# EAGLE design geiger_counter (EAGLE 6.6.0)
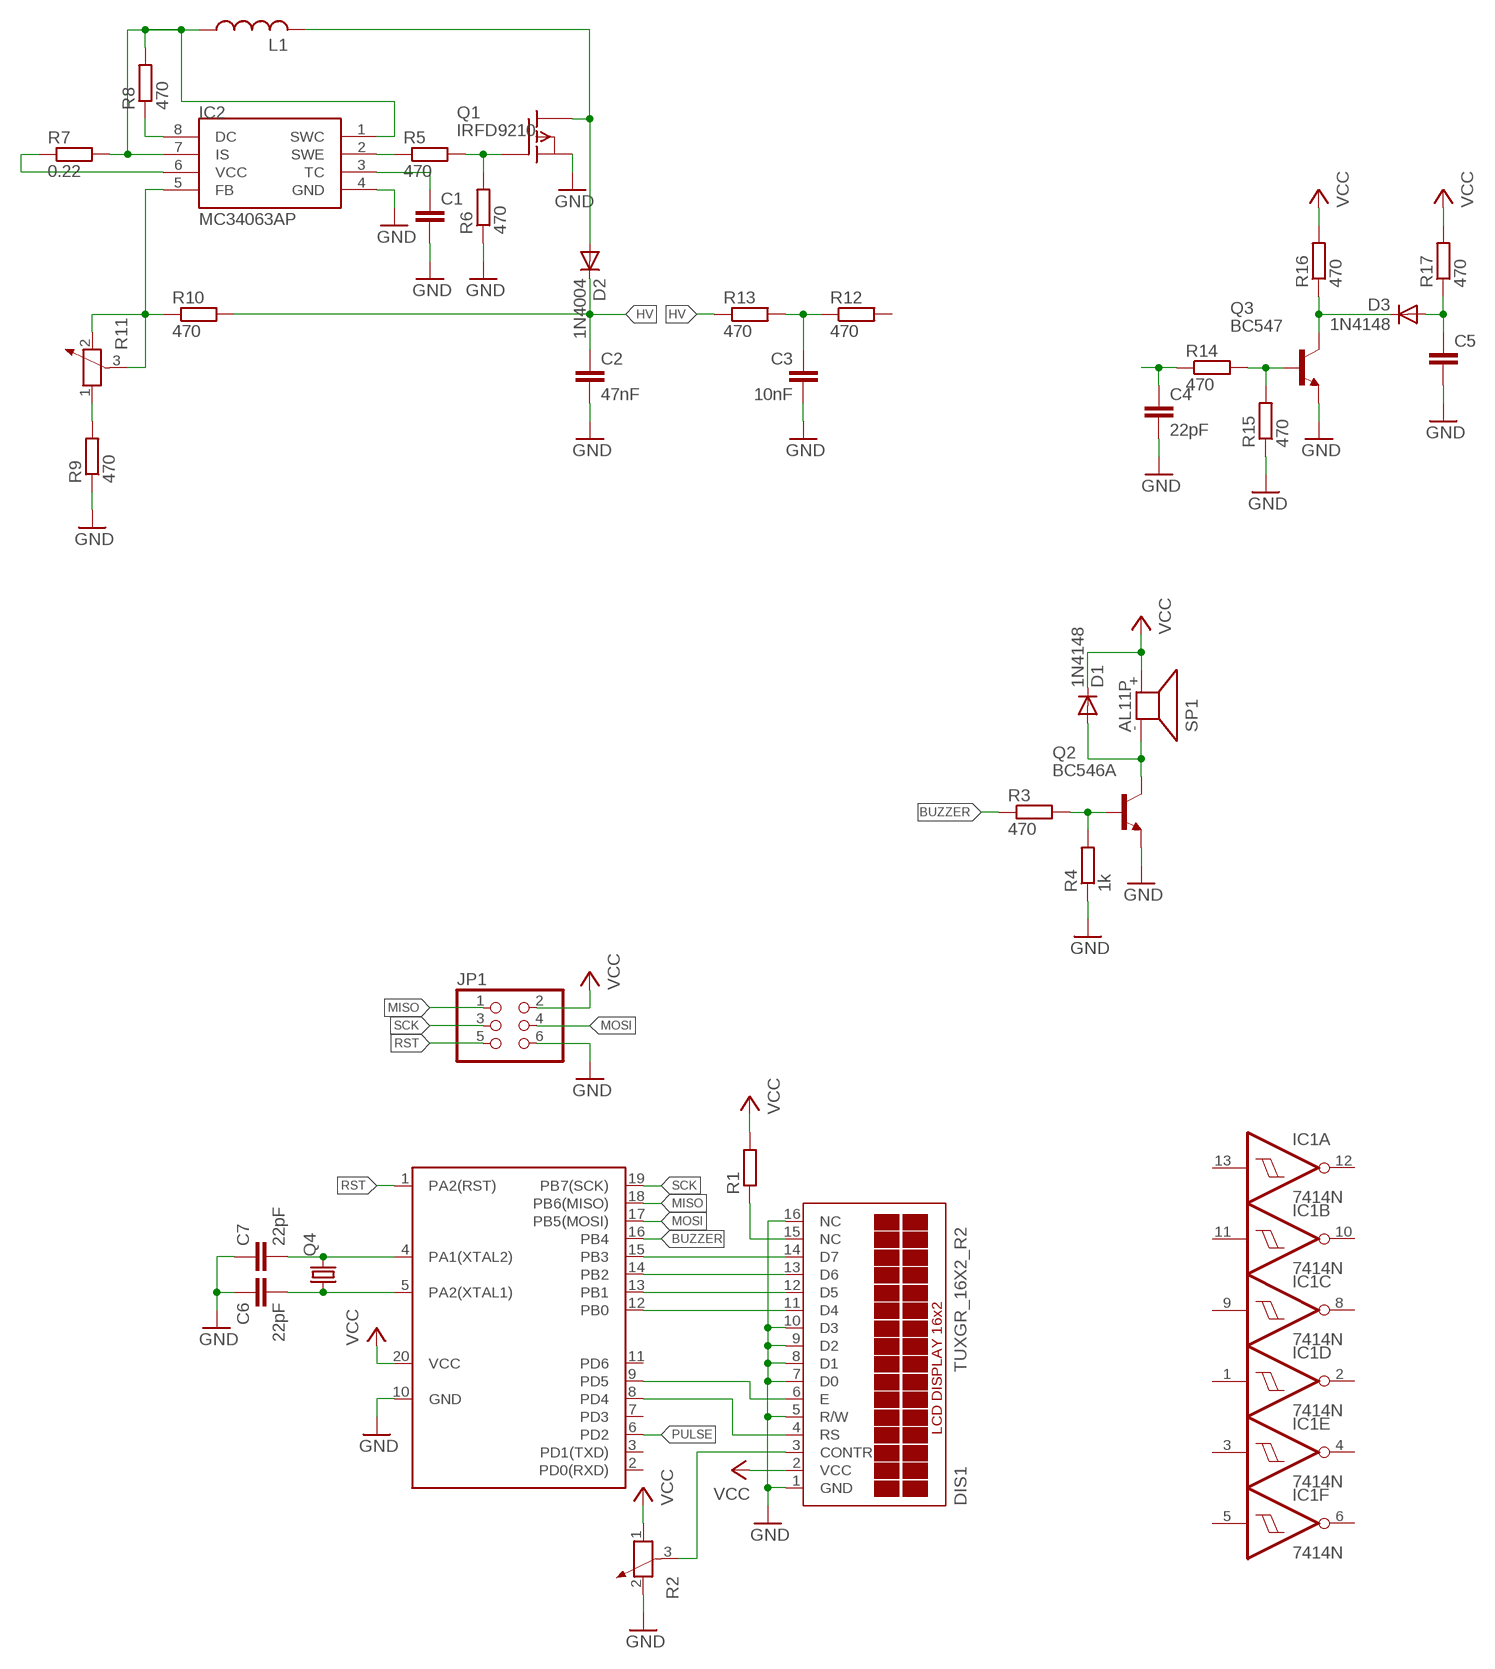
[diagram p0: schematic, sheet 1]

## Parts
C1  C-EU050-024X044  [C050-024X044]
C2  47nF  C-EU075-052X106  [C075-052X106]
C3  10nF  C-EU075-032X103  [C075-032X103]
C4  22pF  C-EU050-024X044  [C050-024X044]
C5  C-EU050-024X044  [C050-024X044]
C6  22pF  C-EU050-024X044  [C050-024X044]
C7  22pF  C-EU050-024X044  [C050-024X044]
D1  1N4148  1N4148DO35-7  [DO35-7]
D2  1N4004  [DO41-10]
D3  1N4148  1N4148DO35-7  [DO35-7]
DIS1  TUXGR_16X2_R2  [TUXGR_16X2_R2]
IC1  7414N  [DIL14]
IC2  MC34063AP  [DIL08]
JP1  PINHD-2X3  [2X03]
L1  L-US6000-XXX-RC  [6000-XXXX-RC]
Q1  IRFD9210  [DIL04]
Q2  BC546A  [TO92-EBC]
Q3  BC547  -NPN-TO92-EBC  [TO92-EBC]
Q4  CRYSTALHC18U-V  [HC18U-V]
R1  R-EU_0207/15  [0207/15]
R2  POTENTIOMETER_PT-10  [PT-10]
R3  470  R-EU_0204/7  [0204/7]
R4  1k  R-EU_0204/7  [0204/7]
R5  470  R-EU_0204/7  [0204/7]
R6  470  R-EU_0204/7  [0204/7]
R7  0.22  R-EU_0617/17  [0617/17]
R8  470  R-EU_0204/7  [0204/7]
R9  470  R-EU_0204/7  [0204/7]
R10  470  R-EU_0204/7  [0204/7]
R11  POTENTIOMETER_PT-10  [PT-10]
R12  470  R-EU_0204/7  [0204/7]
R13  470  R-EU_0204/7  [0204/7]
R14  470  R-EU_0204/7  [0204/7]
R15  470  R-EU_0204/7  [0204/7]
R16  470  R-EU_0204/7  [0204/7]
R17  470  R-EU_0204/7  [0204/7]
SP1  AL11P  [AL11P]
U$1  TINY2313  [DIL20]

## Nets
BUZZER: R3.1 U$1.16(PB4)
GND: C1.2 C2.2 C3.2 C4.2 C5.2 C6.1 C7.1 DIS1.1(GND) DIS1.5(R/W) DIS1.7(D0) DIS1.8(D1) DIS1.9(D2) DIS1.10(D3) DIS1.16(NC) IC2.4(GND) JP1.6 Q1.2(S) Q2.E Q3.E R2.2 R4.1 R6.1 R9.1 R15.1 U$1.10(GND)
HV: C2.1 D2.C R10.2 R13.1
MISO: JP1.1 U$1.18(PB6(MISO))
MOSI: JP1.4 U$1.17(PB5(MOSI))
N$1: DIS1.11(D4) U$1.12(PB0)
N$2: DIS1.12(D5) U$1.13(PB1)
N$3: DIS1.13(D6) U$1.14(PB2)
N$4: DIS1.14(D7) U$1.15(PB3)
N$5: DIS1.6(E) U$1.9(PD5)
N$6: DIS1.4(RS) U$1.8(PD4)
N$7: DIS1.15(NC) R1.1
N$8: DIS1.3(CONTR) R2.3
N$9: IC2.8(DC) R8.1
N$10: D1.A Q2.C SP1.-
N$11: IC2.1(SWC) IC2.7(IS) L1.1 R7.2 R8.2
N$12: Q2.B R3.2 R4.2
N$13: C1.1 IC2.3(TC)
N$14: IC2.2(SWE) R5.1
N$15: Q1.1(G) R5.2 R6.2
N$16: D2.A L1.2 Q1.3(D) Q1.4(D)
N$17: IC2.5(FB) R10.1 R11.2 R11.3
N$18: Q3.B R14.2 R15.2
N$19: IC2.6(VCC) R7.1
N$20: R9.2 R11.1
N$21: C3.1 R12.1 R13.2
N$22: C4.1 R14.1
N$23: D3.C Q3.C R16.1
N$24: C5.1 D3.A R17.1
N$25: C7.2 Q4.2 U$1.4(PA1(XTAL2))
N$26: C6.2 Q4.1 U$1.5(PA2(XTAL1))
PULSE: U$1.6(PD2)
RST: JP1.5 U$1.1(PA2(RST))
SCK: JP1.3 U$1.19(PB7(SCK))
VCC: D1.C DIS1.2(VCC) JP1.2 R1.2 R2.1 R16.2 R17.2 SP1.+ U$1.20(VCC)
Unconnected: IC1.1(D:I) IC1.2(D:O) IC1.3(E:I) IC1.4(E:O) IC1.5(F:I) IC1.6(F:O) IC1.8(C:O) IC1.9(C:I) IC1.10(B:O) IC1.11(B:I) IC1.12(A:O) IC1.13(A:I) R12.2 U$1.2(PD0(RXD)) U$1.3(PD1(TXD)) U$1.7(PD3) U$1.11(PD6)

## Power pins joined to a net without a drawn wire
GND: IC1.7(P:GND)
VCC: IC1.14(P:VCC)

## Library data of the parts
C1-C7 = rcl:C-EU: CAPACITOR, European symbol
D1 D3 = diode:1N4148: DIODE high speed (Philips)
D2 = diode:1N4004: DIODE general purpose rectifier, 1 A
DIS1 = display-lcd:TUXGR_16X2_R2: Tuxgraphics LCD display 16x2 characters reflective, without background light Source: tuxgr_12x2_r2.pdf; OC_FARNELL: unknown; OC_NEWARK: unknown
IC1 = 74xx-eu:74*14: Hex schmitt trigger INVERTER
IC2 = mc34063:MC34063
JP1 = pinhead:PINHD-2X3: PIN HEADER
L1 = rcl:L-US: INDUCTOR, American symbol
Q1 = transistor-fet:IRFD9210: P-Channel Enhancement MOSFET
Q2 = transistor-npn:BC546*: NPN Transistor
Q3 = transistor:*-NPN-: NPN Transistror BF959 corrected 2008.03.06
Q4 = crystal:CRYSTAL: CRYSTAL; OC_FARNELL: unknown; OC_NEWARK: unknown
R1 R3-R10 R12-R17 = rcl:R-EU_: RESISTOR, European symbol
R2 R11 = rcl:POTENTIOMETER_: Potentiometer
SP1 = buzzer:AL11P: SPEAKER Source: Buerklin; OC_FARNELL: unknown; OC_NEWARK: unknown
U$1 = atmel:TINY2313

## Board
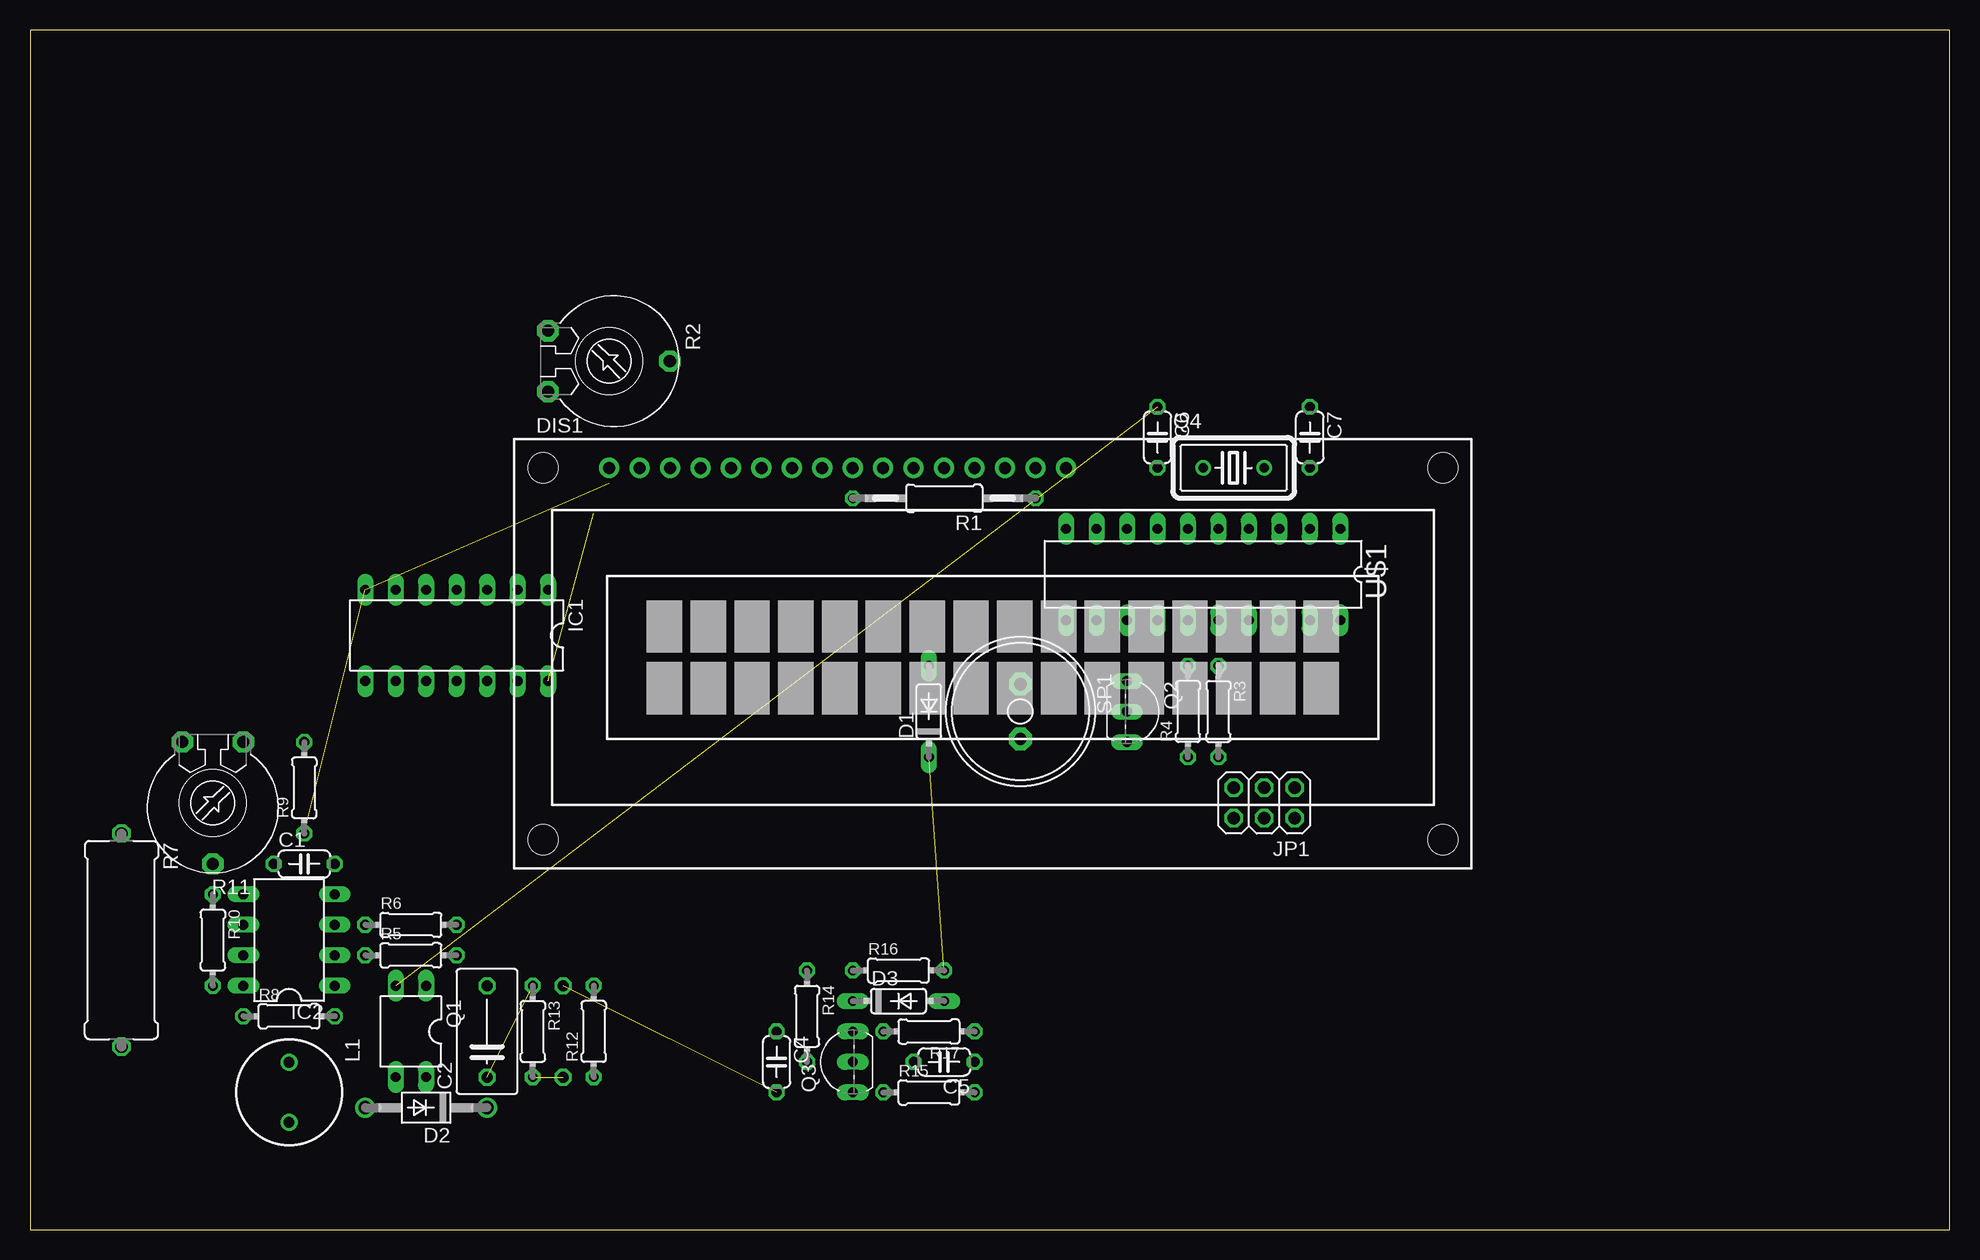
[diagram p1: board, top side]
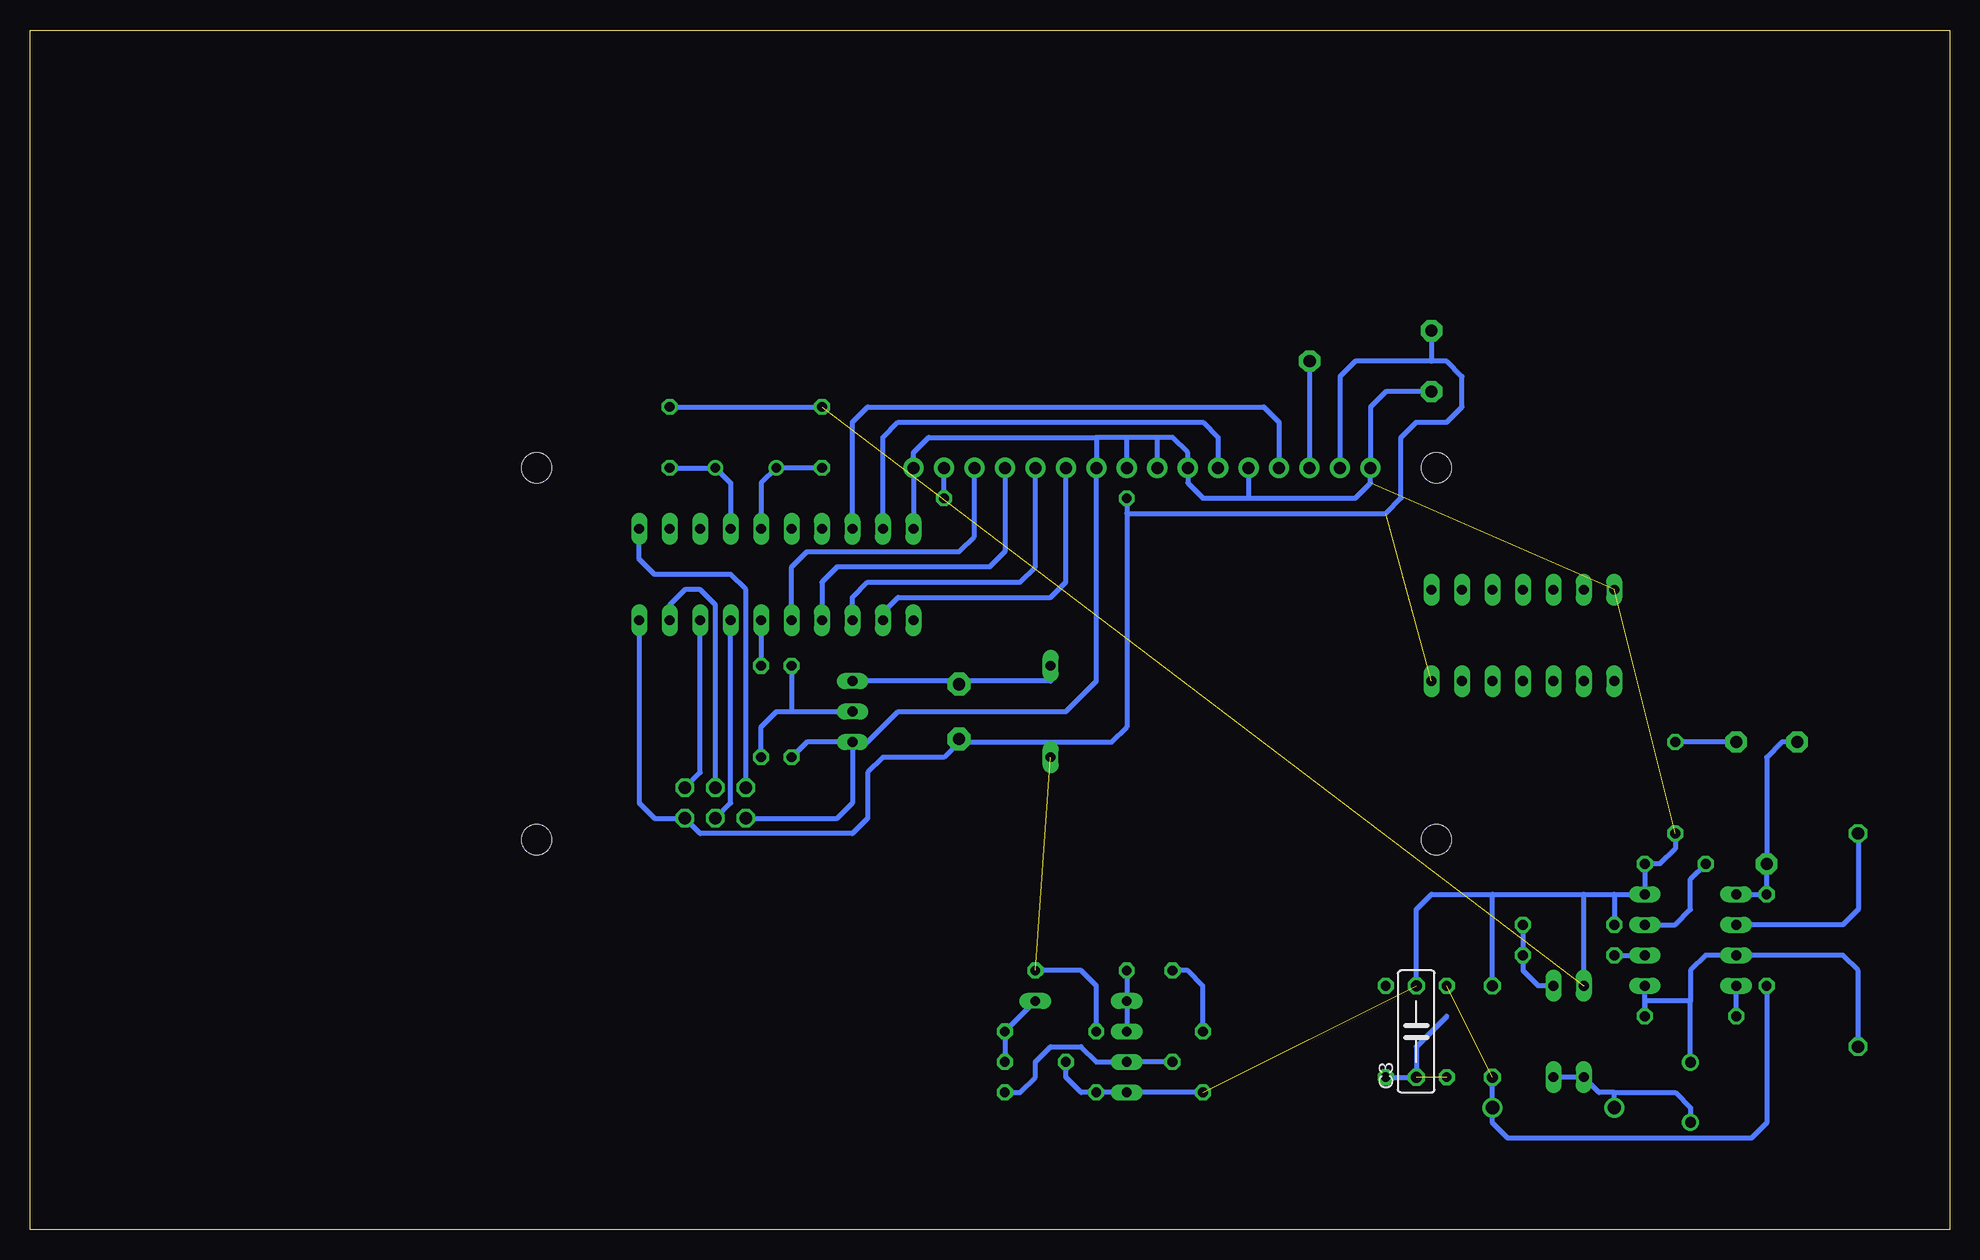
[diagram p2: board, bottom side, seen from below]

Size 160 x 100 mm. Coordinates in mm from the lower left corner, seen from the top.
Outline: 0,0 160,0 160,100 0,100 0,0
Copper layers (1*16): Top 0.035mm / dielectric 1.5mm / Bottom 0.035mm
Design rules "default": minimum track width 10mil, minimum drill 24mil, track to track 8mil, track to pad 8mil, pad to pad 8mil, via to via 8mil, smd to smd 8mil, copper to edge 40mil, drill to drill 8mil, minimum pad ring 10mil, minimum via ring 8mil, stop-mask expansion 4mil, vias tented up to drill 0mil, thermal gap 10mil

### Footprints (pad centres in the part's own frame; a part is rotated, then mirrored left to right if it is on the bottom)
C050-024X044 = drill 0.813 octagon: 1 -2.54,0; 2 2.54,0
C075-052X106 = drill 0.914 octagon: 1 -3.81,0; 2 3.81,0
C075-032X103 = drill 0.914 octagon: 1 -3.81,0; 2 3.81,0
DO35-7 = drill 0.813 long: A 3.81,0; C -3.81,0
DO41-10 = drill 1.118: A 5.08,0; C -5.08,0
TUXGR_16X2_R2 = drill 1 pad 1.676: 1 -33.02,15.24; 2 -30.48,15.24; 3 -27.94,15.24; 4 -25.4,15.24; 5 -22.86,15.24; 6 -20.32,15.24; 7 -17.78,15.24; 8 -15.24,15.24; 9 -12.7,15.24; 10 -10.16,15.24; 11 -7.62,15.24; 12 -5.08,15.24; 13 -2.54,15.24; 14 0,15.24; 15 2.54,15.24; 16 5.08,15.24 | hole 2.5: -38.52,-15.76; 36.48,-15.76; -38.52,15.24; 36.48,15.24
DIL14 = drill 0.813 long: 1 -7.62,-3.81; 2 -5.08,-3.81; 3 -2.54,-3.81; 4 0,-3.81; 5 2.54,-3.81; 6 5.08,-3.81; 7 7.62,-3.81; 8 7.62,3.81; 9 5.08,3.81; 10 2.54,3.81; 11 0,3.81; 12 -2.54,3.81; 13 -5.08,3.81; 14 -7.62,3.81
DIL08 = drill 0.813 long: 1 -3.81,-3.81; 2 -1.27,-3.81; 3 1.27,-3.81; 4 3.81,-3.81; 5 3.81,3.81; 6 1.27,3.81; 7 -1.27,3.81; 8 -3.81,3.81
2X03 = drill 1.016 octagon: 1 -2.54,-1.27; 2 -2.54,1.27; 3 0,-1.27; 4 0,1.27; 5 2.54,-1.27; 6 2.54,1.27
6000-XXXX-RC = drill 0.9 pad 1.422: 1 -2.5,0; 2 2.5,0
DIL04 = drill 0.813 long: 1 -1.27,-3.81; 2 1.27,-3.81; 3 1.27,3.81; 4 -1.27,3.81
TO92-EBC = drill 0.813 long: B 0,-1.27; C -2.54,-1.27; E 2.54,-1.27
TO92-EBC' = drill 0.813 long: B 0,-1.27; C 2.54,-1.27; E -2.54,-1.27
HC18U-V = drill 0.813: 1 -2.54,0; 2 2.54,0
0207/15 = drill 0.813 octagon: 1 -7.62,0; 2 7.62,0
PT-10 = drill 1.016 pad 1.778 octagon: 1 -2.54,-5.08; 2 2.54,-5.08; 3 0,5.08
0204/7 = drill 0.813 octagon: 1 -3.81,0; 2 3.81,0
0617/17 = drill 1.016 octagon: 1 -8.89,0; 2 8.89,0
AL11P = drill 1.016 pad 1.905 octagon: + 2.286,0; - -2.286,0
DIL20 = drill 0.813 long: 1 -11.43,-3.81; 2 -8.89,-3.81; 3 -6.35,-3.81; 4 -3.81,-3.81; 5 -1.27,-3.81; 6 1.27,-3.81; 7 3.81,-3.81; 8 6.35,-3.81; 9 8.89,-3.81; 10 11.43,-3.81; 11 11.43,3.81; 12 8.89,3.81; 13 6.35,3.81; 14 3.81,3.81; 15 1.27,3.81; 16 -1.27,3.81; 17 -3.81,3.81; 18 -6.35,3.81; 19 -8.89,3.81; 20 -11.43,3.81

### Placement (x,y rotation side)
C1  22.86,30.48 0 top
C2  38.1,16.51 90 top
C3  44.45,16.51 90 bottom
C4  62.23,13.97 270 top
C5  76.2,13.97 180 top
C6  93.98,66.04 270 top
C7  106.68,66.04 270 top
D1  74.93,43.18 90 top
D2  33.02,10.16 180 top
D3  72.39,19.05 0 top
DIS1  81.28,48.26 0 top
IC1  35.56,49.53 180 top
IC2  21.59,24.13 90 top
JP1  102.87,35.56 180 top
L1  21.59,11.43 270 top
Q1  31.75,16.51 180 top
Q2  92.71,43.18 270 top
Q3  BC547  [TO92-EBC']  67.31,13.97 90 top
Q4  100.33,63.5 0 top
R1  76.2,60.96 180 top
R2  48.26,72.39 270 top
R3  99.06,43.18 270 top
R4  96.52,43.18 90 top
R5  31.75,22.86 0 top
R6  31.75,25.4 0 top
R7  7.62,24.13 270 top
R8  21.59,17.78 0 top
R9  22.86,36.83 90 top
R10  15.24,24.13 270 top
R11  15.24,35.56 180 top
R12  46.99,16.51 90 top
R13  41.91,16.51 270 top
R14  64.77,17.78 270 top
R15  74.93,11.43 0 top
R16  72.39,21.59 0 top
R17  74.93,16.51 180 top
SP1  82.55,43.18 270 top
U$1  97.79,54.61 180 top

### Tracks (layer width: path | path; a pad name or v marks a point on that pad's centre or on a via)
BUZZER
  Bottom 0.406: U$1.16 R3.1
GND  (4 unrouted)
  Bottom 0.406: 71.12,66.04 85.09,66.04 86.36,64.77 DIS1.16 U$1.10 | 71.12,66.04 DIS1.10 71.12,45.72 73.66,43.18 87.63,43.18 90.17,40.64 Q2.E | 66.04,66.04 64.77,66.04 63.5,64.77 DIS1.7 63.5,62.23 62.23,60.96 58.42,60.96 | 66.04,66.04 68.58,66.04 | 68.58,66.04 71.12,66.04 | DIS1.8 66.04,66.04 | DIS1.9 68.58,66.04 | 58.42,60.96 49.53,60.96 48.26,62.23 DIS1.1 48.26,68.58 46.99,69.85 R2.2 | DIS1.5 58.42,60.96 | JP1.6 92.71,34.29 91.44,35.56 Q2.E | Q2.E 95.25,40.64 R4.1 | Q1.2 30.48,27.94 | 27.94,27.94 R6.1 | C2.2 38.1,27.94 | 38.1,27.94 30.48,27.94 | 30.48,27.94 27.94,27.94 | 27.94,27.94 IC2.4 C1.2 24.13,30.48 22.86,31.75 R9.1 | C3.2 44.45,26.67 43.18,27.94 38.1,27.94 | C4.2 Q3.E R15.1 72.39,11.43 73.66,12.7 C5.2 | C7.1 C6.1
HV  (1 unrouted)
  Bottom 0.406: R10.2 15.24,8.89 16.51,7.62 36.83,7.62 38.1,8.89 D2.C C2.1
MISO
  Bottom 0.406: JP1.1 104.14,38.1 U$1.18
MOSI
  Bottom 0.406: JP1.4 101.6,35.56 U$1.17
N$1
  Bottom 0.406: U$1.12 88.9,51.44 87.63,52.7 74.93,52.7 73.66,53.98 DIS1.11
N$2
  Bottom 0.406: U$1.13 91.44,52.7 90.17,53.98 77.47,53.98 76.2,55.24 DIS1.12
N$3
  Bottom 0.406: DIS1.13 78.74,56.52 80.01,55.24 92.71,55.24 93.98,53.98 U$1.14
N$4
  Bottom 0.406: U$1.15 96.52,55.24 95.25,56.52 82.55,56.52 81.28,57.78 DIS1.14
N$5
  Bottom 0.406: U$1.9 88.9,66.04 87.63,67.31 62.23,67.31 60.96,66.04 DIS1.6
N$6
  Bottom 0.406: U$1.8 91.44,67.31 90.17,68.58 57.15,68.58 55.88,67.31 DIS1.4
N$7
  Bottom 0.406: R1.1 DIS1.15
N$8
  Bottom 0.406: R2.3 DIS1.3
N$9
  Bottom 0.406: R8.1 IC2.8
N$10
  Bottom 0.406: SP1.- 82.55,45.72 | 82.55,45.72 Q2.C | D1.A 74.93,45.72 82.55,45.72
N$11
  Bottom 0.406: R7.2 7.62,21.59 8.89,22.86 IC2.7 20.32,22.86 21.59,21.59 21.59,19.05 | IC2.1 R8.2 25.4,19.05 21.59,19.05 | L1.1 21.59,13.97 21.59,19.05
N$12
  Bottom 0.406: R4.2 96.52,43.18 | 96.52,43.18 Q2.B | R3.2 99.06,41.91 97.79,43.18 96.52,43.18
N$13
  Bottom 0.406: IC2.3 22.86,25.4 21.59,26.67 21.59,29.21 C1.1
N$14
  Bottom 0.406: R5.1 IC2.2
N$15
  Bottom 0.406: R6.2 R5.2 35.56,21.59 34.29,20.32 Q1.1
N$16
  Bottom 0.406: Q1.4 Q1.3 29.21,11.43 27.94,11.43 | D2.A 27.94,11.43 | 27.94,11.43 22.86,11.43 21.59,10.16 L1.2
N$17
  Bottom 0.406: IC2.5 R10.1 R11.3 15.24,39.37 13.97,40.64 R11.2
N$18
  Bottom 0.406: R14.2 Q3.B 71.12,13.97 72.39,15.24 74.93,15.24 76.2,13.97 76.2,12.7 77.47,11.43 R15.2
N$19
  Bottom 0.406: R7.1 7.62,26.67 8.89,25.4 IC2.6
N$20
  Bottom 0.406: R11.1 R9.2
N$21  (1 unrouted)
  Bottom 0.406: 41.91,17.78 44.45,15.24 C3.1 R12.1
N$22
  Bottom 0.406: C4.1 62.23,20.32 63.5,21.59 R14.1
N$23
  Bottom 0.406: R16.1 D3.C Q3.C
N$24
  Bottom 0.406: D3.A R17.1 C5.1
N$25
  Bottom 0.406: U$1.4 101.6,62.23 Q4.2 C7.2
N$26
  Bottom 0.406: C6.2 Q4.1 99.06,62.23 U$1.5
RST
  Bottom 0.406: JP1.5 100.33,53.34 101.6,54.61 107.95,54.61 109.22,55.88 U$1.1
SCK
  Bottom 0.406: JP1.3 102.87,52.07 104.14,53.34 105.41,53.34 106.68,52.07 U$1.19
VCC  (2 unrouted)
  Bottom 0.406: 68.58,59.69 46.99,59.69 45.72,60.96 45.72,66.04 44.45,67.31 41.91,67.31 40.64,68.58 40.64,71.12 41.91,72.39 43.18,72.39 | 43.18,72.39 49.53,72.39 50.8,71.12 DIS1.2 | R2.1 43.18,72.39 | U$1.20 109.22,35.56 107.95,34.29 JP1.2 104.14,33.02 91.44,33.02 90.17,34.29 90.17,38.1 88.9,39.37 83.82,39.37 82.55,40.64 | R1.2 68.58,59.69 | 68.58,59.69 68.58,41.91 69.85,40.64 74.93,40.64 | SP1.+ 82.55,40.64 | 82.55,40.64 74.93,40.64 | D1.C 74.93,40.64 | R17.2 71.12,20.32 72.39,21.59 R16.2